# Altium schematic sheet Rotary_breakout_module.SchDoc: Rotary encoder breakout module
size A4; Author: Andrea Mancini; DocumentNumber: 1; Revision: 1; SheetNumber: 1; SheetTotal: 1; FileName: Rotary_breakout_module.SchDoc; DescriptionLine1: Breakout module for; DescriptionLine2: common rotary encoder; DescriptionLine3: modules with pin welded
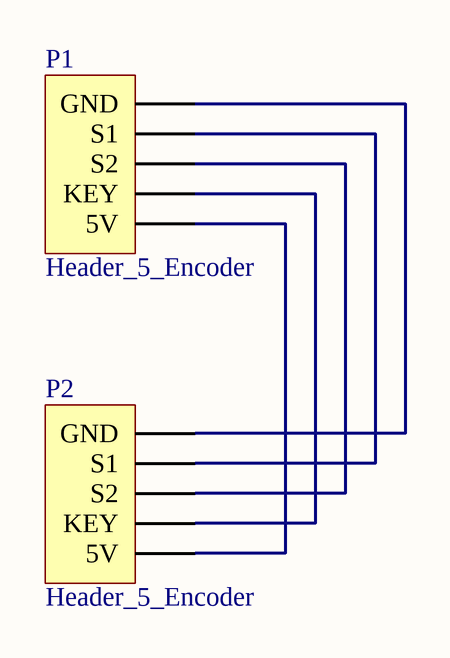
[diagram p0: Rotary_breakout_module.SchDoc]

## Parts
P1  Header_5_Encoder  [HDR1X5_Encoder]
P2  Header_5_Encoder  [HDR1X5_Encoder]

## Nets
NetP1_1: P1.1(GND) P2.1(GND)
NetP1_2: P1.2(S1) P2.2(S1)
NetP1_3: P1.3(S2) P2.3(S2)
NetP1_4: P1.4(KEY) P2.4(KEY)
NetP1_5: P1.5(5V) P2.5(5V)

## Notes on the sheet
- Title
- Size:
- Date:
- A4
- Number:
- Time:
- Revision:
- Sheet
- of
- Author:
- File:

## Library data of the parts
P1 P2 = Header_5_Encoder: Header 5 pins to connect one encoder